# Altium schematic sheet Morpheus_MCU.SchDoc: Bluetooth Low Energy MCU
size Letter; Author: Dyke Shaffer; CompanyName: Hello, Inc.; Engineer: Dyke Shaffer; Organization: Hello, Inc.; Revision: DVT; SheetNumber: 4; SheetTotal: 4
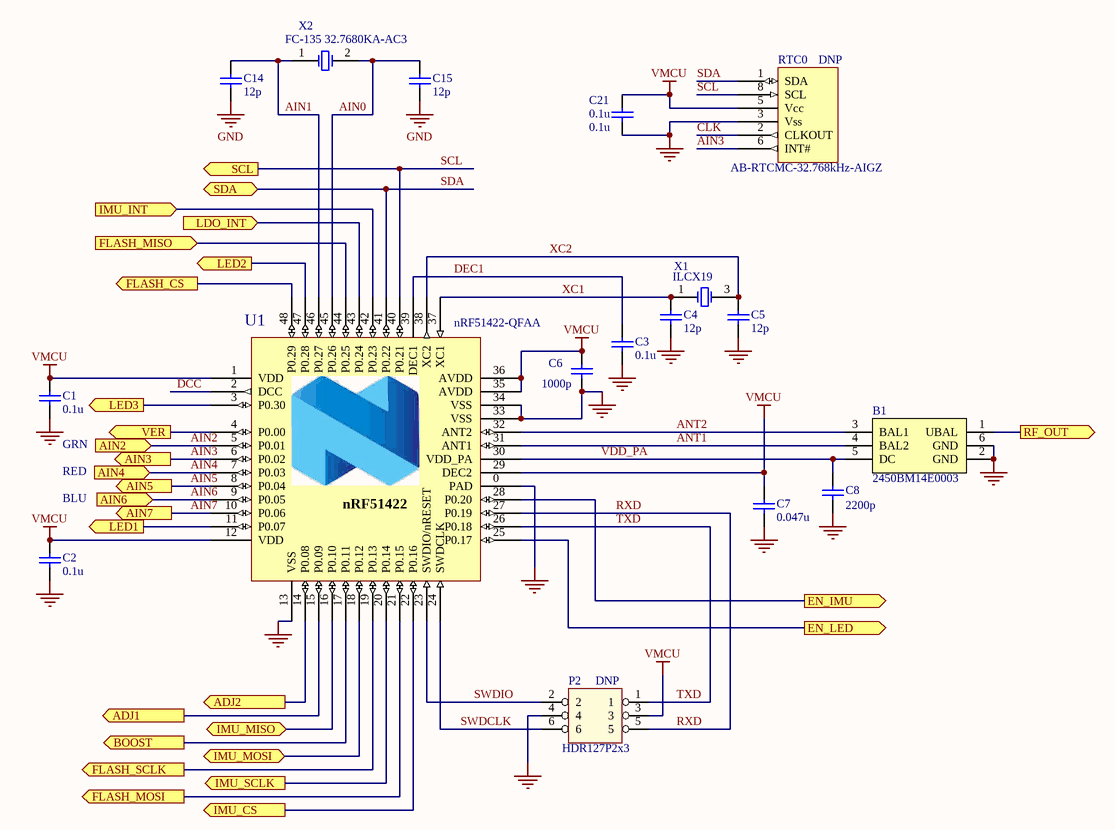
[diagram p0: Morpheus_MCU.SchDoc]

## Parts
B1  2450BM14E0003  [DFN50P160X80X70-6N]
C1  0.1u  [CAP0402_SENSE_DVT]
C2  0.1u  [CAP0402_SENSE_DVT]
C3  0.1u  [CAP0402_SENSE_DVT]
C4  12p  [CAP0402_SENSE_DVT]
C5  12p  [CAP0402_SENSE_DVT]
C6  1000p  [CAP0201_SENSE_DVT]
C7  value 0.047u  [CAP0201_SENSE_DVT]  (hidden comment: C_0.047u_10_16_X5R_0201)
C8  2200p  [CAP0201_SENSE_DVT]
C14  12p  [CAP0402_SENSE_DVT]
C15  12p  [CAP0402_SENSE_DVT]
C21  0.1u  [CAP0402_SENSE_DVT]
P2  DNP  PN: HDR127P2x3  [HDR1.27-2X3-N]
RTC0  DNP  [8-CLCC]
U1  nRF51422-QFAA  [VQFN40P600X600X100-48]
X1  ILCX19  [ILCX19]
X2  FC-135 32.7680KA-AC3  [Epson_FC-135]

## Ports
ADJ1 (out), ADJ2 (out), AIN2 (in), AIN3 (out), AIN4 (in), AIN5 (out), AIN6 (in), AIN7 (out), BOOST (out), EN_IMU (out), EN_LED (out), FLASH_CS (out), FLASH_MISO (in), FLASH_MOSI (out), FLASH_SCLK (out), IMU_CS (out), IMU_INT (in), IMU_MISO, IMU_MOSI, IMU_SCLK (out), LDO_INT (in), LED1 (out), LED2 (out), LED3 (out), RF_OUT (out), SCL (out), SDA, VER (out)

## Nets
GND: B1.2(GND) B1.6(GND) C1.1 C2.1 C3.1 C4.1 C5.1 C6.1 C7.1 C8.1 C14.1 C15.1 C21.1 P2.4 RTC0.3(Vss) U1.0(PAD) U1.13(VSS) U1.33(VSS) U1.34(VSS)
VMCU: C1.2 C2.2 C6.2 C7.2 C21.2 P2.3 RTC0.5(Vcc) U1.1(VDD) U1.12(VDD) U1.29(DEC2) U1.35(AVDD) U1.36(AVDD)
ADJ1: U1.15(P0.09) ; port ADJ1
ADJ2: U1.14(P0.08) ; port ADJ2
AIN0: C15.2 U1.45(P0.26) X2.2
AIN1: C14.2 U1.46(P0.27) X2.1
AIN2: U1.5(P0.01) ; port AIN2
AIN3: RTC0.6(INT#) U1.6(P0.02) ; port AIN3
AIN4: U1.7(P0.03) ; port AIN4
AIN5: U1.8(P0.04) ; port AIN5
AIN6: U1.9(P0.05) ; port AIN6
AIN7: U1.10(P0.06) ; port AIN7
ANT1: B1.4(BAL2) U1.31(ANT1)
ANT2: B1.3(BAL1) U1.32(ANT2)
BOOST: U1.17(P0.11) ; port BOOST
CLK: RTC0.2(CLKOUT)
DCC: U1.2(DCC)
DEC1: C3.2 U1.39(DEC1)
EN_IMU: U1.28(P0.20) ; port EN_IMU
EN_LED: U1.25(P0.17) ; port EN_LED
FLASH_CS: U1.48(P0.29) ; port FLASH_CS
FLASH_MISO: U1.44(P0.25) ; port FLASH_MISO
FLASH_MOSI: U1.21(P0.15) ; port FLASH_MOSI
FLASH_SCLK: U1.19(P0.13) ; port FLASH_SCLK
IMU_CS: U1.22(P0.16) ; port IMU_CS
IMU_INT: U1.42(P0.23) ; port IMU_INT
IMU_MISO: U1.16(P0.10) ; port IMU_MISO
IMU_MOSI: U1.18(P0.12) ; port IMU_MOSI
IMU_SCLK: U1.20(P0.14) ; port IMU_SCLK
LDO_INT: U1.43(P0.24) ; port LDO_INT
LED1: U1.11(P0.07) ; port LED1
LED2: U1.47(P0.28) ; port LED2
LED3: U1.3(P0.30) ; port LED3
RF_OUT: B1.1(UBAL) ; port RF_OUT
RXD: P2.5 U1.27(P0.19)
SCL: RTC0.8(SCL) U1.40(P0.21) ; port SCL
SDA: RTC0.1(SDA) U1.41(P0.22) ; port SDA
SWDCLK: P2.6 U1.24(SWDCLK)
SWDIO: P2.2 U1.23(SWDIO/nRESET)
TXD: P2.1 U1.26(P0.18)
VDD_PA: B1.5(DC) C8.2 U1.30(VDD_PA)
VER: U1.4(P0.00) ; port VER
XC1: C4.2 U1.37(XC1) X1.1(XTAL1)
XC2: C5.2 U1.38(XC2) X1.3(XTAL2)

Not connected (* = marked no-connect by the designer): RTC0 4(NC) 7(NC)

## Notes on the sheet
- (near C1) GRN
- RED
- (near C2) BLU
- TITLE
- DATE
- DRAWN BY
- REV
- SHEET
- OF
- (in symbol nRF51422_QFAA) nRF51422

## Library data of the parts
B1 = 2450BM14E0003: BALUN FILTER for NORDIC nRF51x22 QFN; Vendor: Johanson; Hello_PN: 270-00361; item_category: RF Component; PN: 2450BM14E0003
C1-C3 C21 = C_0.1u_10_50_X7R_0402: CAP CER 0.1UF 50V 10% X7R 0402; Vendor: Murata; PN: GRM155R71H104KE14D; Hello_PN: 225-00468; item_category: Capacitor; Value: 0.1u; Size: 0402; Tolerance: 10%; Voltage: 50V; Temp: X7R
C4 C5 C14 C15 = C_12p_5_50_C0G_0402: CAP CER 12PF 50V 5% NP0 0402; Vendor: Murata; PN: GRM1555C1H120JA01D; Temp: C0G; Hello_PN: 225-00333; item_category: Capacitor; Value: 12p; Size: 0402; Tolerance: 5%; Voltage: 50V
C6 = C_1000p_10_25_X7R_0201: CAP CER 1000PF 25V 10% X7R 0201; Vendor: Taiyo Yuden; PN: TMK063B7102KP-F; Hello_PN: 225-00376; item_category: Capacitor; Value: 1000p; Size: 0201; Tolerance: 10%; Voltage: 25V; Temp: X7R
C7 = C_0.047u_10_16_X5R_0201: CAP CER 0.047UF 16V 10% X5R 0201; Vendor: Murata; PN: GRM033R61C473KE84D; Hello_PN: 225-00377; item_category: Capacitor; Size: 0201; Tolerance: 10%; Voltage: 16V; Temp: X5R
C8 = C_2200p_5_16_X7R_0201: CAP CER 2200PF 16V 10% X7R 0201; Vendor: Yageo; PN: CC0201KRX7R7BB222; Tolerance: 5 %; Hello_PN: 225-00471; item_category: Capacitor; Value: 2200p; Size: 0201; Voltage: 16V; Type: X7R
P2 = HDR1.27-2x3-N: Value: HDR1.27-2X3-N
RTC0 = AB-RTCMC-32.768kHz-AIGZ: Abracon I2C RTC w/ integrated XO; PN: AB-RTCMC-32.768kHz-AIGZ
U1 = nRF51422_QFAA: Multi-protocol Bluetooth Low Energy, ANT and 2.4GHz proprietary system-on-chip; Vendor: Nordic Semiconductor; Hello_PN: 265-00264; item_category: IC Mixed Signal; PN: nRF51422-QFAA
X1 = ILCX19: OSC ILCX19-FB5F18-16.000MHz; Hello_PN: 250-00092; Vendor: ILSI; item_category: Oscillator/Crystal; PN: ILCX19
X2 = Espon_FC-135 32.7680KA-AC3: Crystals 32.768KHz 20ppm 9.0pF; Vendor: Epson; Hello_PN: 250-00341; item_category: Oscillator/Crystal; PN: FC-135 32.7680KA-AC3